# EAGLE schematic COM-TC (EAGLE 8.4.3)
CREVISION: V1; DESIGNER: Henrik K. B. Jensen

## Sheet 1 of 4
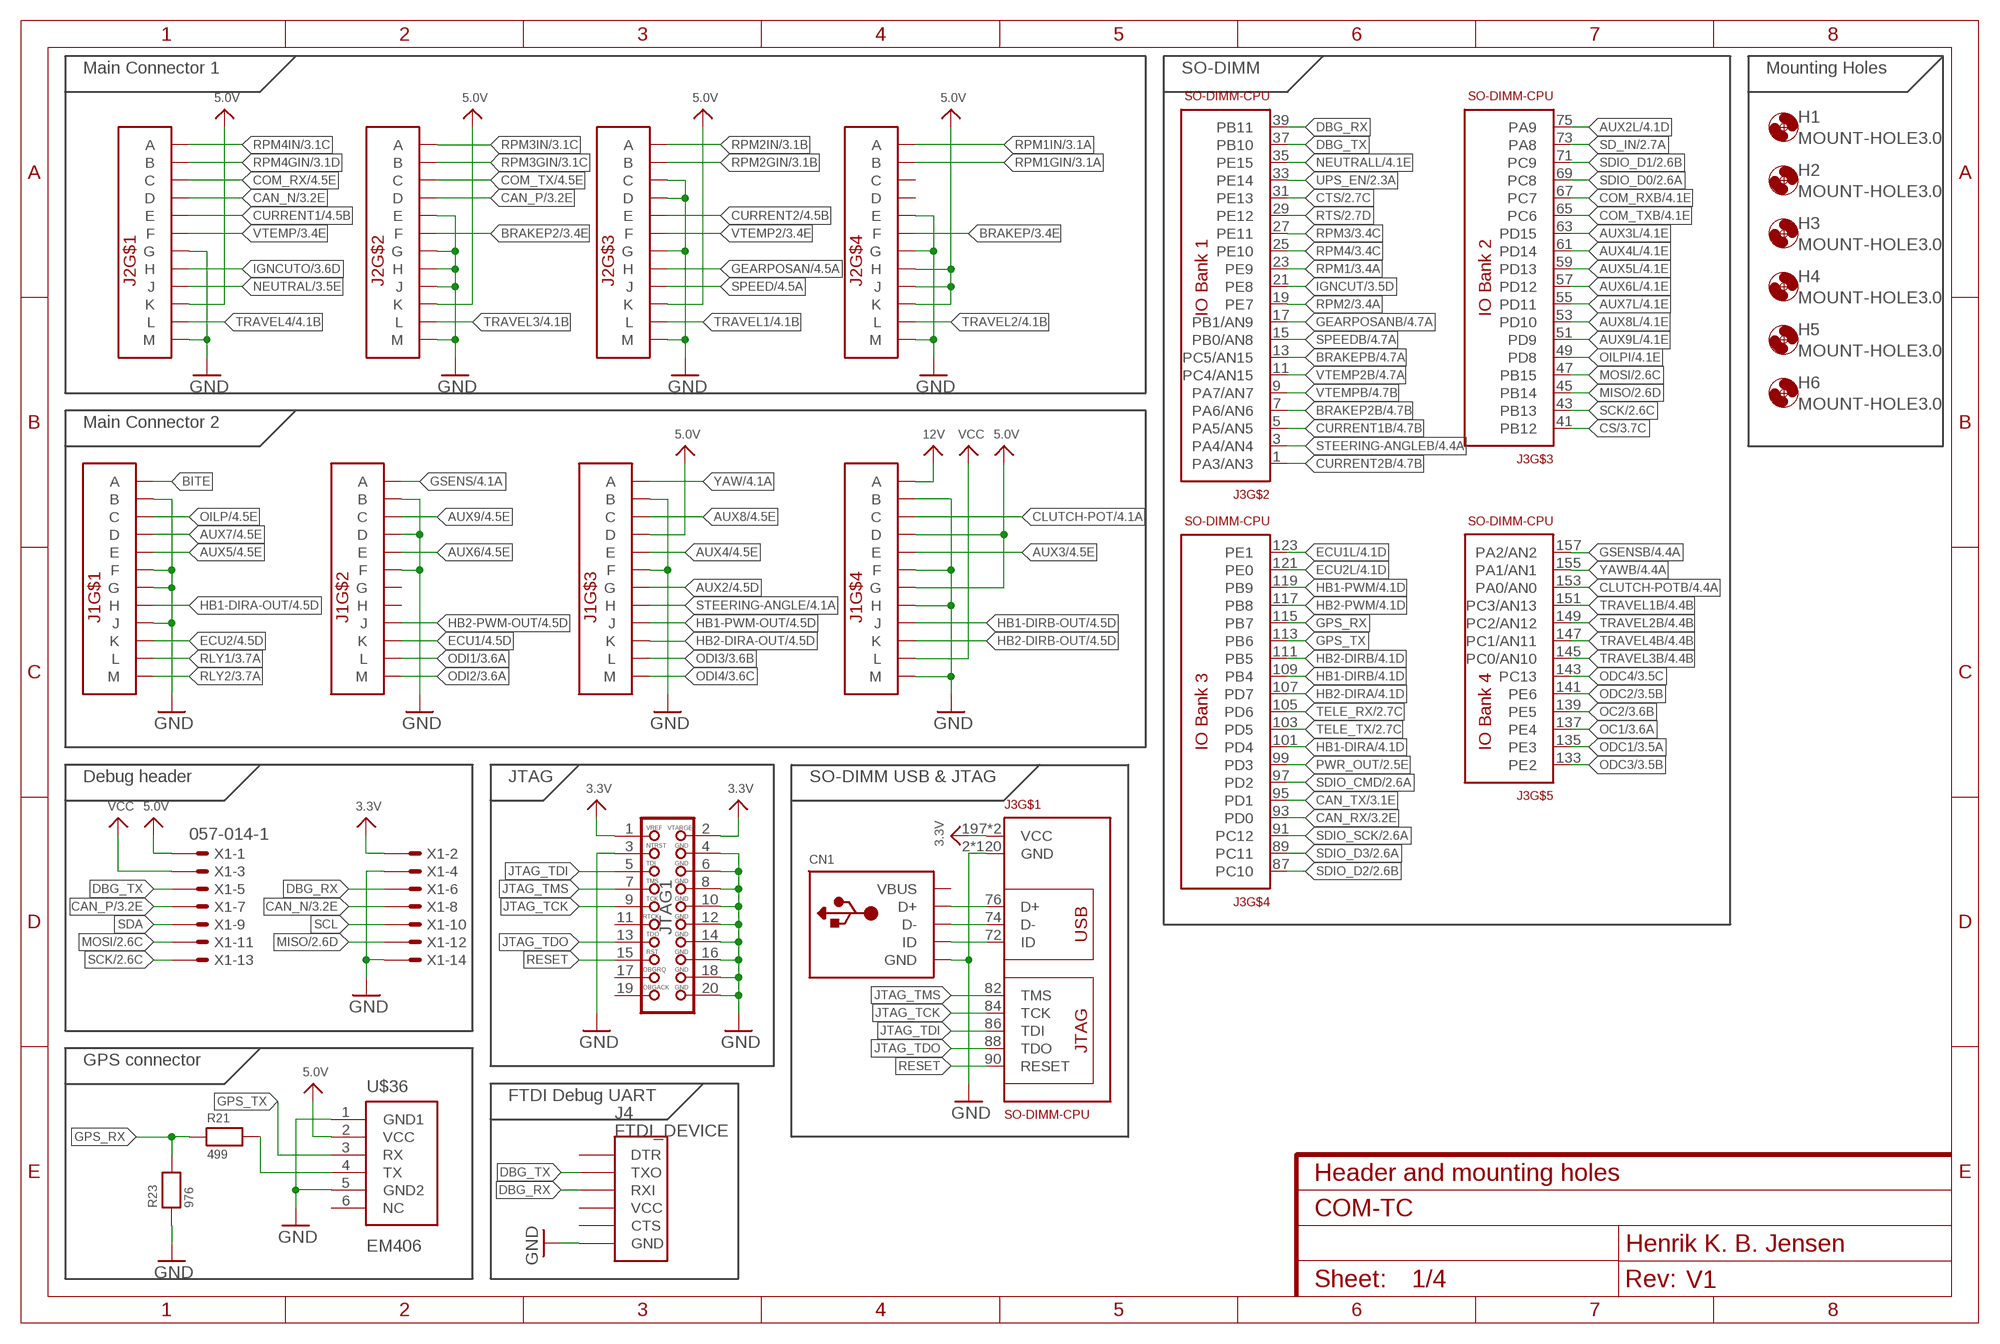
[diagram p0: schematic, sheet 1]

### Parts
CN1  USBMINIBLARGE  [USB-MINIB_LARGER]
H1  MOUNT-HOLE3.0  [3,0]
H2  MOUNT-HOLE3.0  [3,0]
H3  MOUNT-HOLE3.0  [3,0]
H4  MOUNT-HOLE3.0  [3,0]
H5  MOUNT-HOLE3.0  [3,0]
H6  MOUNT-HOLE3.0  [3,0]
J1  CON1  AUTOCONNECTOR  [AUTOCONNECTOR]
J2  CON1  AUTOCONNECTOR  [AUTOCONNECTOR]
J3  SO-DIMM-CPU  [SODIMM-CONNECTOR-2.5V]
J4  FTDI_DEVICE  [FTDI_DEVICE_SIDE]
JTAG1  JTAG-ARM  [JTAG-ARM]
R21  499  RESISTOR_0603  [_0603]
R23  976  RESISTOR_0603  [_0603]
U$36  EM406  [EM406]
X1  057-014-1  [057-014-1]

### Nets
3.3V: J3.197(VCC) J3.199(VCC) JTAG1.1 JTAG1.2 X1.2 ; also sheet 2,3,4
5.0V: J1.D3(D) J1.D4(D) J1.G4(G) J2.H4(H) J2.J4(J) J2.K1(K) J2.K2(K) J2.K3(K) J2.K4(K) U$36.2(VCC) X1.1 ; also sheet 2,3,4
12V: J1.A4(A) ; also sheet 2
_N: CN1.D- J3.74(D-)
_P: CN1.D+ J3.76(D+)
AUX2: J1.G3(G) ; also sheet 4
AUX2L: J3.75(PA9) ; also sheet 4
AUX3: J1.E4(E) ; also sheet 4
AUX3L: J3.63(PD15) ; also sheet 4
AUX4: J1.E3(E) ; also sheet 4
AUX4L: J3.61(PD14) ; also sheet 4
AUX5: J1.E1(E) ; also sheet 4
AUX5L: J3.59(PD13) ; also sheet 4
AUX6: J1.E2(E) ; also sheet 4
AUX6L: J3.57(PD12) ; also sheet 4
AUX7: J1.D1(D) ; also sheet 4
AUX7L: J3.55(PD11) ; also sheet 4
AUX8: J1.C3(C) ; also sheet 4
AUX8L: J3.53(PD10) ; also sheet 4
AUX9: J1.C2(C) ; also sheet 4
AUX9L: J3.51(PD9) ; also sheet 4
BITE: J1.A1(A)
BRAKEP: J2.F4(F) ; also sheet 3,4
BRAKEP2: J2.F2(F) ; also sheet 3,4
BRAKEP2B: J3.7(PA6/AN6) ; also sheet 4
BRAKEPB: J3.13(PC5/AN15) ; also sheet 4
CAN_N: J2.D1(D) X1.8 ; also sheet 3
CAN_P: J2.D2(D) X1.7 ; also sheet 3
CAN_RX: J3.93(PD0) ; also sheet 3
CAN_TX: J3.95(PD1) ; also sheet 3
CLUTCH-POT: J1.C4(C) ; also sheet 4
CLUTCH-POTB: J3.153(PA0/AN0) ; also sheet 4
COM_RX: J2.C1(C) ; also sheet 4
COM_RXB: J3.67(PC7) ; also sheet 4
COM_TX: J2.C2(C) ; also sheet 4
COM_TXB: J3.65(PC6) ; also sheet 4
CS: J3.41(PB12) ; also sheet 3
CTS: J3.31(PE13) ; also sheet 2
CURRENT1: J2.E1(E) ; also sheet 4
CURRENT1B: J3.5(PA5/AN5) ; also sheet 4
CURRENT2: J2.E3(E) ; also sheet 4
CURRENT2B: J3.1(PA3/AN3) ; also sheet 4
DBG_RX: J3.39(PB11) J4.P$3(RXI) X1.6
DBG_TX: J3.37(PB10) J4.P$2(TXO) X1.5
ECU1: J1.K2(K) ; also sheet 4
ECU1L: J3.123(PE1) ; also sheet 4
ECU2: J1.K1(K) ; also sheet 4
ECU2L: J3.121(PE0) ; also sheet 4
GEARPOSAN: J2.H3(H) ; also sheet 4
GEARPOSANB: J3.17(PB1/AN9) ; also sheet 4
GND: CN1.GND J1.B1(B) J1.B2(B) J1.B3(B) J1.B4(B) J1.D2(D) J1.F1(F) J1.F2(F) J1.F3(F) J1.F4(F) J1.G1(G) J1.H4(H) J1.J1(J) J1.M4(M) J2.C3(C) J2.D3(D) J2.E2(E) J2.E4(E) J2.G1(G) J2.G2(G) J2.G3(G) J2.G4(G) J2.H2(H) J2.J2(J) J2.M1(M) J2.M2(M) J2.M3(M) J2.M4(M) J3.2(GND) J3.4(GND) J3.6(GND) J3.8(GND) J3.10(GND) J3.12(GND) J3.14(GND) J3.16(GND) J3.18(GND) J3.20(GND) J3.22(GND) J3.24(GND) J3.26(GND) J3.28(GND) J3.30(GND) J3.32(GND) J3.34(GND) J3.36(GND) J3.38(GND) J3.40(GND) J3.42(GND) J3.44(GND) J3.46(GND) J3.48(GND) J3.50(GND) J3.52(GND) J3.54(GND) J3.56(GND) J3.58(GND) J3.60(GND) J3.62(GND) J3.64(GND) J3.66(GND) J3.68(GND) J3.70(GND) J3.77(GND) J3.78(GND) J3.79(GND) J3.80(GND) J3.81(GND) J3.83(GND) J3.85(GND) J3.92(GND) J3.94(GND) J3.96(GND) J3.98(GND) J3.100(GND) J3.102(GND) J3.104(GND) J3.106(GND) J3.108(GND) J3.110(GND) J3.112(GND) J3.114(GND) J3.116(GND) J3.118(GND) J3.120(GND) J3.122(GND) J3.124(GND) J3.125(GND) J3.126(GND) J3.127(GND) J3.128(GND) J3.129(GND) J3.130(GND) J3.131(GND) J3.132(GND) J3.134(GND) J3.136(GND) J3.138(GND) J3.140(GND) J3.142(GND) J3.144(GND) J3.146(GND) J3.148(GND) J3.150(GND) J3.152(GND) J3.154(GND) J3.156(GND) J3.158(GND) J3.159(GND) J3.160(GND) J3.161(GND) J3.162(GND) J3.163(GND) J3.164(GND) J3.165(GND) J3.166(GND) J3.167(GND) J3.168(GND) J3.169(GND) J3.170(GND) J3.171(GND) J3.172(GND) J3.173(GND) J3.174(GND) J3.175(GND) J3.176(GND) J3.177(GND) J3.178(GND) J3.179(GND) J3.180(GND) J3.181(GND) J3.182(GND) J3.183(GND) J3.184(GND) J3.185(GND) J3.186(GND) J3.187(GND) J3.188(GND) J3.189(GND) J3.190(GND) J3.191(GND) J3.192(GND) J3.193(GND) J3.194(GND) J3.195(GND) J3.196(GND) J3.198(GND) J3.200(GND) J4.P$6(GND) JTAG1.3 JTAG1.4 JTAG1.6 JTAG1.8 JTAG1.10 JTAG1.12 JTAG1.14 JTAG1.16 JTAG1.18 JTAG1.20 R23.1 U$36.1(GND1) U$36.5(GND2) X1.4 X1.14 ; also sheet 2,3,4
GPS_RX: J3.115(PB7) R21.1 R23.2
GPS_TX: J3.113(PB6) U$36.3(RX)
GSENS: J1.A2(A) ; also sheet 4
GSENSB: J3.157(PA2/AN2) ; also sheet 4
HB1-DIRA: J3.101(PD4) ; also sheet 4
HB1-DIRA-OUT: J1.H1(H) ; also sheet 4
HB1-DIRB: J3.109(PB4) ; also sheet 4
HB1-DIRB-OUT: J1.J4(J) ; also sheet 4
HB1-PWM: J3.119(PB9) ; also sheet 4
HB1-PWM-OUT: J1.J3(J) ; also sheet 4
HB2-DIRA: J3.107(PD7) ; also sheet 4
HB2-DIRA-OUT: J1.K3(K) ; also sheet 4
HB2-DIRB: J3.111(PB5) ; also sheet 4
HB2-DIRB-OUT: J1.K4(K) ; also sheet 4
HB2-PWM: J3.117(PB8) ; also sheet 4
HB2-PWM-OUT: J1.J2(J) ; also sheet 4
IGNCUT: J3.21(PE8) ; also sheet 3
IGNCUTO: J2.H1(H) ; also sheet 3
JTAG_TCK: J3.84(TCK) JTAG1.9
JTAG_TDI: J3.86(TDI) JTAG1.5
JTAG_TDO: J3.88(TDO) JTAG1.13
JTAG_TMS: J3.82(TMS) JTAG1.7
MISO: J3.45(PB14) X1.12 ; also sheet 2,3
MOSI: J3.47(PB15) X1.11 ; also sheet 2,3
N$79: CN1.ID J3.72(ID)
NEUTRAL: J2.J1(J) ; also sheet 3,4
NEUTRALL: J3.35(PE15) ; also sheet 4
OC1: J3.137(PE4) ; also sheet 3
OC2: J3.139(PE5) ; also sheet 3
ODC1: J3.135(PE3) ; also sheet 3
ODC2: J3.141(PE6) ; also sheet 3
ODC3: J3.133(PE2) ; also sheet 3
ODC4: J3.143(PC13) ; also sheet 3
ODI1: J1.L2(L) ; also sheet 3
ODI2: J1.M2(M) ; also sheet 3
ODI3: J1.L3(L) ; also sheet 3
ODI4: J1.M3(M) ; also sheet 3
OILP: J1.C1(C) ; also sheet 4
OILPI: J3.49(PD8) ; also sheet 4
PWR_OUT: J3.99(PD3) ; also sheet 2
RESET: J3.90(RESET) JTAG1.15
RLY1: J1.L1(L) ; also sheet 3
RLY2: J1.M1(M) ; also sheet 3
RPM1: J3.23(PE9) ; also sheet 3
RPM1GIN: J2.B4(B) ; also sheet 3
RPM1IN: J2.A4(A) ; also sheet 3
RPM2: J3.19(PE7) ; also sheet 3
RPM2GIN: J2.B3(B) ; also sheet 3
RPM2IN: J2.A3(A) ; also sheet 3
RPM3: J3.27(PE11) ; also sheet 3
RPM3GIN: J2.B2(B) ; also sheet 3
RPM3IN: J2.A2(A) ; also sheet 3
RPM4: J3.25(PE10) ; also sheet 3
RPM4GIN: J2.B1(B) ; also sheet 3
RPM4IN: J2.A1(A) ; also sheet 3
RTS: J3.29(PE12) ; also sheet 2
RXD1: R21.2 U$36.4(TX)
SCK: J3.43(PB13) X1.13 ; also sheet 2,3
SCL: X1.10
SD_IN: J3.73(PA8) ; also sheet 2
SDA: X1.9
SDIO_CMD: J3.97(PD2) ; also sheet 2
SDIO_D0: J3.69(PC8) ; also sheet 2
SDIO_D1: J3.71(PC9) ; also sheet 2
SDIO_D2: J3.87(PC10) ; also sheet 2
SDIO_D3: J3.89(PC11) ; also sheet 2
SDIO_SCK: J3.91(PC12) ; also sheet 2
SPEED: J2.J3(J) ; also sheet 4
SPEEDB: J3.15(PB0/AN8) ; also sheet 4
STEERING-ANGLE: J1.H3(H) ; also sheet 4
STEERING-ANGLEB: J3.3(PA4/AN4) ; also sheet 4
TELE_RX: J3.105(PD6) ; also sheet 2
TELE_TX: J3.103(PD5) ; also sheet 2
TRAVEL1: J2.L3(L) ; also sheet 4
TRAVEL1B: J3.151(PC3/AN13) ; also sheet 4
TRAVEL2: J2.L4(L) ; also sheet 4
TRAVEL2B: J3.149(PC2/AN12) ; also sheet 4
TRAVEL3: J2.L2(L) ; also sheet 4
TRAVEL3B: J3.145(PC0/AN10) ; also sheet 4
TRAVEL4: J2.L1(L) ; also sheet 4
TRAVEL4B: J3.147(PC1/AN11) ; also sheet 4
UPS_EN: J3.33(PE14) ; also sheet 2
VCC: J1.L4(L) X1.3 ; also sheet 2
VTEMP: J2.F1(F) ; also sheet 3,4
VTEMP2: J2.F3(F) ; also sheet 3,4
VTEMP2B: J3.11(PC4/AN15) ; also sheet 4
VTEMPB: J3.9(PA7/AN7) ; also sheet 4
YAW: J1.A3(A) ; also sheet 4
YAWB: J3.155(PA1/AN1) ; also sheet 4
Unconnected: J1.G2(G) J1.H2(H) J2.C4(C) J2.D4(D) J4.P$1(DTR) J4.P$4(VCC) J4.P$5(CTS) JTAG1.11 JTAG1.17 JTAG1.19 U$36.6(NC)

### Notes on the sheet
- Main Connector 1 | SO-DIMM | Mounting Holes
- Main Connector 2
- Debug header | JTAG | SO-DIMM USB & JTAG
- GPS connector
- FTDI Debug UART
- Header and mounting holes

## Sheet 2 of 4
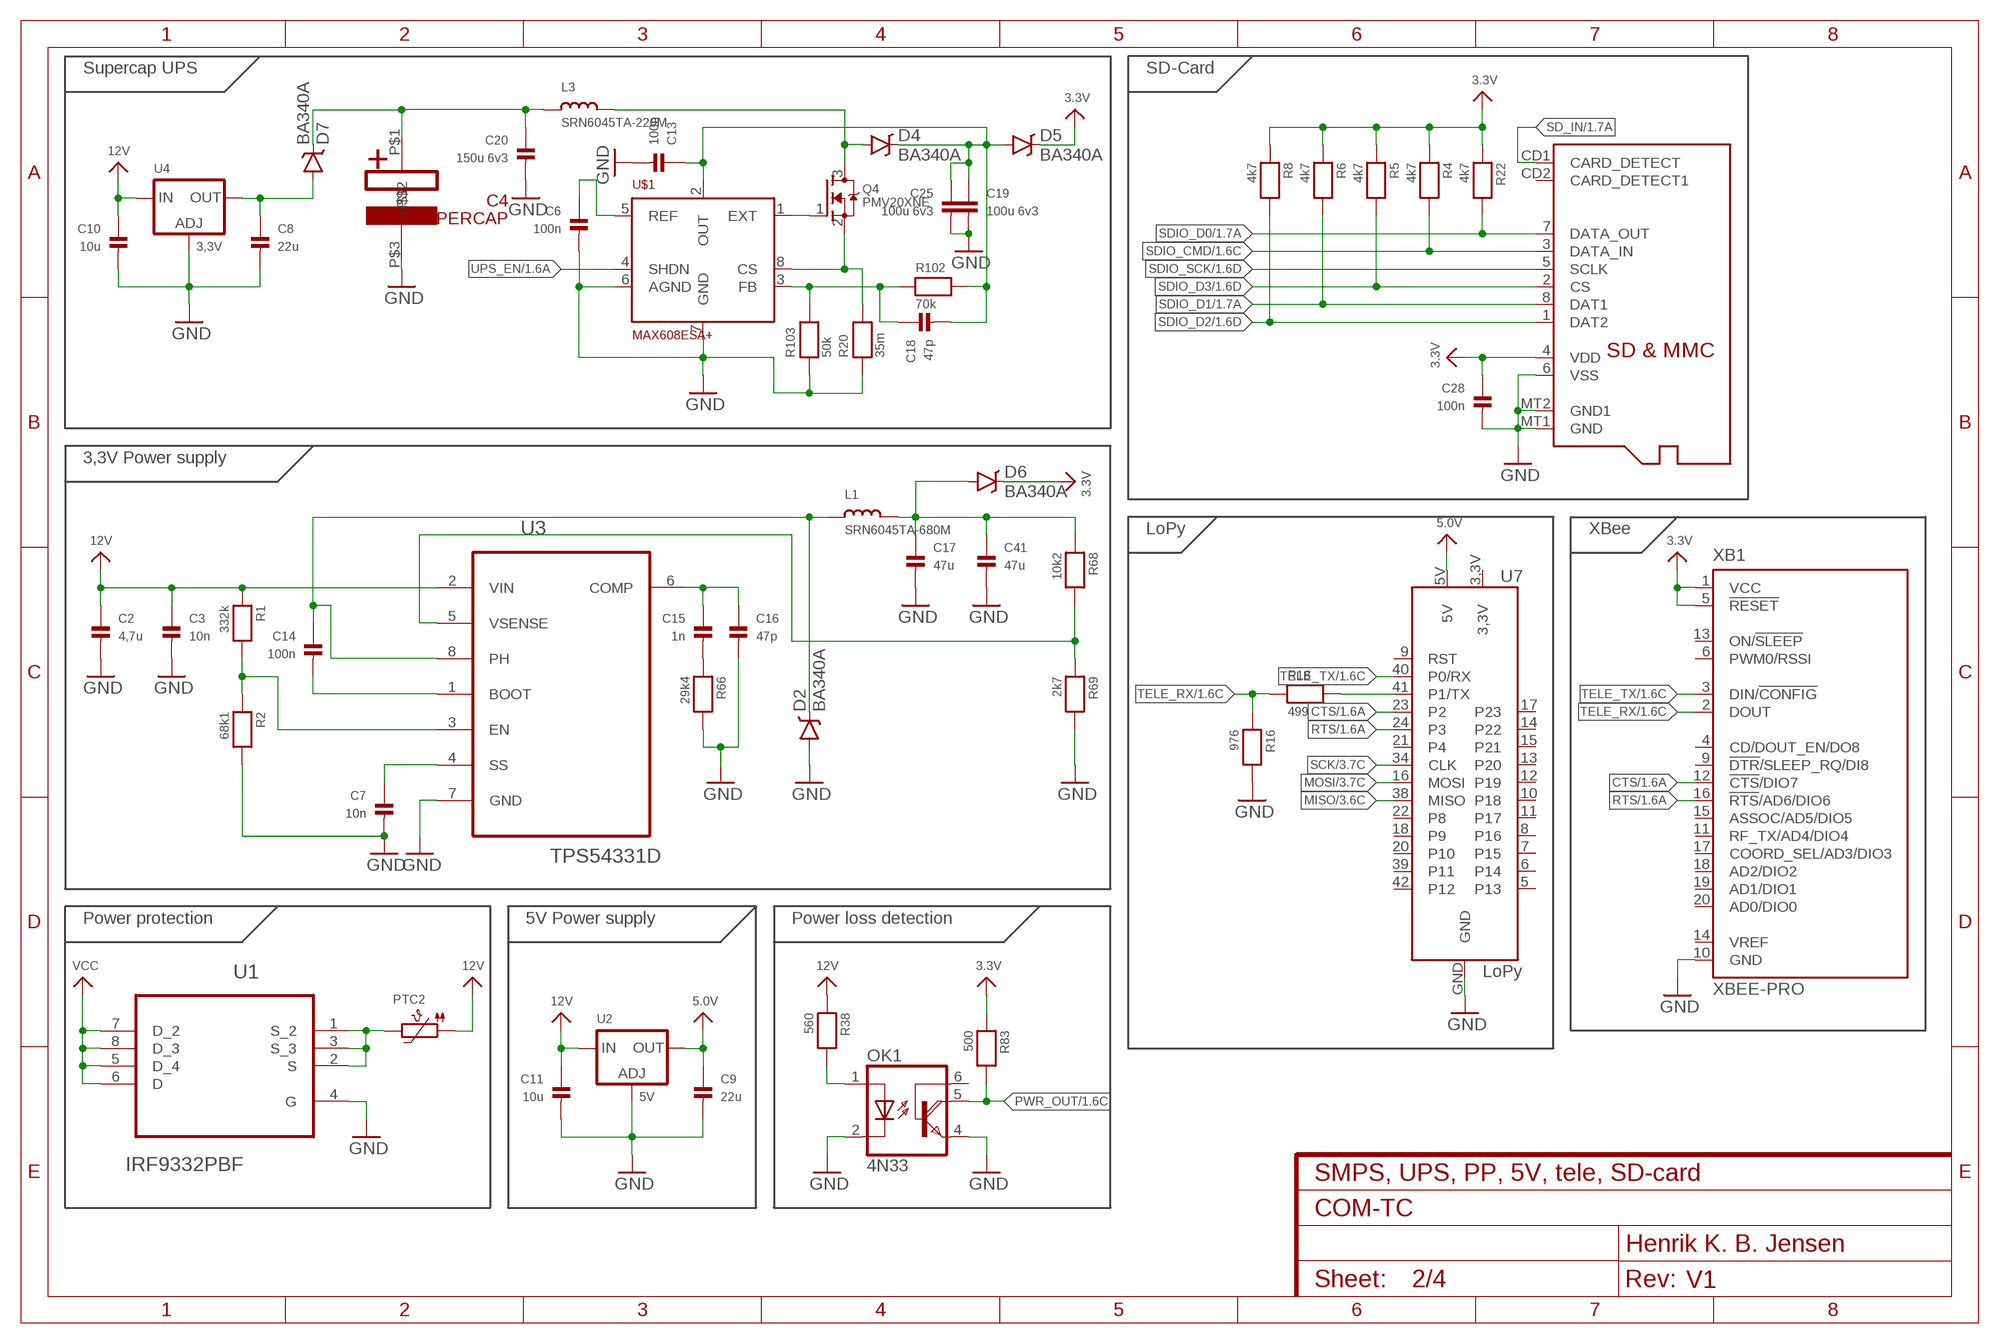
[diagram p1: schematic, sheet 2]

### Parts
C2  4,7u  CAP_CERAMIC_0805  [_0805]
C3  10n  CAP_CERAMIC_0603  [_0603]
C4  SUPERCAP  [SUPERCAP]
C6  100n  CAP_CERAMIC_0603  [_0603]
C7  10n  CAP_CERAMIC_0603  [_0603]
C8  22u  CAP_CERAMIC_0805  [_0805]
C9  22u  CAP_CERAMIC_0805  [_0805]
C10  10u  CAP_CERAMIC_0805  [_0805]
C11  10u  CAP_CERAMIC_0805  [_0805]
C13  100n  CAP_CERAMIC_0603  [_0603]
C14  100n  CAP_CERAMIC_0603  [_0603]
C15  1n  CAP_CERAMIC_0603  [_0603]
C16  47p  CAP_CERAMIC_0603  [_0603]
C17  47u  CAP_CERAMIC_0805  [_0805]
C18  47p  CAP_CERAMIC_0603  [_0603]
C19  100u 6v3  CAP_CERAMIC1206  [1206]
C20  150u 6v3  CAP_CERAMIC1206  [1206]
C25  100u 6v3  CAP_CERAMIC1206  [1206]
C28  100n  CAP_CERAMIC_0603  [_0603]
C41  47u  CAP_CERAMIC_0805  [_0805]
D2  BA340A  B340A  [SMA-DIODE]
D4  BA340A  B340A  [SMA-DIODE]
D5  BA340A  B340A  [SMA-DIODE]
D6  BA340A  B340A  [SMA-DIODE]
D7  BA340A  B340A  [SMA-DIODE]
L1  SRN6045TA-680M  INDUCTORTDK_VLC6045  [INDUCTOR_6X6MM_TDK_VLC6045]
L3  SRN6045TA-220M  INDUCTORTDK_VLC6045  [INDUCTOR_6X6MM_TDK_VLC6045]
OK1  4N33  [DIL06]
PTC2  PTC1812  [PTC1812]
Q4  PMV20XNE  MOSFET-NREFLOW  [SOT23]
R1  332k  RESISTOR_0603  [_0603]
R2  68k1  RESISTOR_0603  [_0603]
R4  4k7  RESISTOR_0603  [_0603]
R5  4k7  RESISTOR_0603  [_0603]
R6  4k7  RESISTOR_0603  [_0603]
R8  4k7  RESISTOR_0603  [_0603]
R16  976  RESISTOR_0603  [_0603]
R18  499  RESISTOR_0603  [_0603]
R20  35m  RESISTOR1206  [1206]
R22  4k7  RESISTOR_0603  [_0603]
R38  560  RESISTOR_0603  [_0603]
R66  29k4  RESISTOR_0603  [_0603]
R68  10k2  RESISTOR_0603  [_0603]
R69  2k7  RESISTOR_0603  [_0603]
R83  500  RESISTOR_0603  [_0603]
R102  70k  RESISTOR_0603  [_0603]
R103  50k  RESISTOR_0603  [_0603]
U1  IRF9332PBF  [SOIC127P600X175-8N]
U2  5V  LM1117SOT223-REFLOW  [SOT223-R]
U3  TPS54331D  [SOIC127P600X175-8N]
U4  3,3V  LM1117SOT223-REFLOW  [SOT223-R]
U7  LoPy  LOPY  [LOPY]
U$1  MAX608ESA+  [SO08]
U$2  MICROSD  [MICROSD]
XB1  XBEE-PRO  [XBEE-PRO]

### Nets
3.3V: C28.1 D5.C D6.C R4.1 R5.1 R6.1 R8.1 R22.1 R83.1 U$2.4(VDD) XB1.1(VCC) XB1.5(!RESET) ; also sheet 1,3,4
5.0V: C9.1 U2.2(OUT) U7.5V ; also sheet 1,3,4
12V: C2.1 C3.1 C10.1 C11.1 PTC2.P$1 R1.1 R38.1 U2.3(IN) U3.2(VIN) U4.3(IN) ; also sheet 1
CTS: U7.23(P2) XB1.12(!CTS!/DIO7) ; also sheet 1
GND: C2.2 C3.2 C4.P$3 C6.2 C7.2 C8.2 C9.2 C10.2 C11.2 C13.2 C16.2 C17.2 C19.2 C20.2 C25.2 C28.2 C41.2 D2.A OK1.2(C) OK1.4(E) R2.2 R16.2 R20.1 R66.2 R69.2 R103.1 U1.4(G) U2.1(ADJ) U3.7(GND) U4.1(ADJ) U7.GND U$1.6(AGND) U$1.7(GND) U$2.6(VSS) U$2.MT1(GND) U$2.MT2(GND1) XB1.10(GND) ; also sheet 1,3,4
MISO: U7.38(MISO) ; also sheet 1,3
MOSI: U7.16(MOSI) ; also sheet 1,3
N$1: C7.1 U3.4(SS)
N$2: R1.2 R2.1 U3.3(EN)
N$3: C17.1 C41.1 D6.A L1.P$2 R68.1
N$4: C8.1 D7.A U4.2(OUT)
N$7: Q4.1(G) U$1.1(EXT)
N$12: PTC2.P$2 U1.1(S_2) U1.2(S) U1.3(S_3)
N$22: OK1.1(A) R38.2
N$27: Q4.2(S) R20.2 U$1.8(CS)
N$28: C13.1 C18.2 C19.1 C25.1 D4.C D5.A R102.2 U$1.2(OUT)
N$29: C6.1 U$1.5(REF)
N$30: C18.1 R102.1 R103.2 U$1.3(FB)
N$35: R18.2 U7.41(P1/TX)
N$36: D4.A L3.P$2 Q4.3(D)
N$37: C14.2 U3.1(BOOT)
N$45: C14.1 D2.C L1.P$1 U3.8(PH)
N$50: C15.2 R66.1
N$66: C15.1 C16.1 U3.6(COMP)
N$72: R68.2 R69.1 U3.5(VSENSE)
PWR_OUT: OK1.5(COL) R83.2 ; also sheet 1
RTS: U7.24(P3) XB1.16(!RTS!/AD6/DIO6) ; also sheet 1
SCK: U7.34(CLK) ; also sheet 1,3
SD_IN: U$2.CD1(CARD_DETECT) ; also sheet 1
SDIO_CMD: R4.2 U$2.3(DATA_IN) ; also sheet 1
SDIO_D0: R22.2 U$2.7(DATA_OUT) ; also sheet 1
SDIO_D1: R6.2 U$2.8(DAT1) ; also sheet 1
SDIO_D2: R8.2 U$2.1(DAT2) ; also sheet 1
SDIO_D3: R5.2 U$2.2(CS) ; also sheet 1
SDIO_SCK: U$2.5(SCLK) ; also sheet 1
SUPERCAP: C4.P$1 C20.1 D7.C L3.P$1
TELE_RX: R16.1 R18.1 XB1.2(DOUT) ; also sheet 1
TELE_TX: U7.40(P0/RX) XB1.3(DIN/!CONFIG) ; also sheet 1
UPS_EN: U$1.4(SHDN) ; also sheet 1
VCC: U1.5(D_4) U1.6(D) U1.7(D_2) U1.8(D_3) ; also sheet 1
Unconnected: OK1.6(B) U7.3,3V U7.5(P13) U7.6(P14) U7.7(P15) U7.8(P16) U7.9(RST) U7.10(P18) U7.11(P17) U7.12(P19) U7.13(P20) U7.14(P22) U7.15(P21) U7.17(P23) U7.18(P9) U7.20(P10) U7.21(P4) U7.22(P8) U7.39(P11) U7.42(P12) U$2.CD2(CARD_DETECT1) XB1.4(CD/DOUT_EN/DO8) XB1.6(PWM0/RSSI) XB1.9(!DTR!/SLEEP_RQ/DI8) XB1.11(RF_TX/AD4/DIO4) XB1.13(ON/!SLEEP) XB1.14(VREF) XB1.15(ASSOC/AD5/DIO5) XB1.17(COORD_SEL/AD3/DIO3) XB1.18(AD2/DIO2) XB1.19(AD1/DIO1) XB1.20(AD0/DIO0)

### Notes on the sheet
- Supercap UPS | SD-Card
- 3,3V Power supply
- LoPy | XBee
- Power protection | 5V Power supply | Power loss detection
- SMPS, UPS, PP, 5V, tele, SD-card

## Sheet 3 of 4
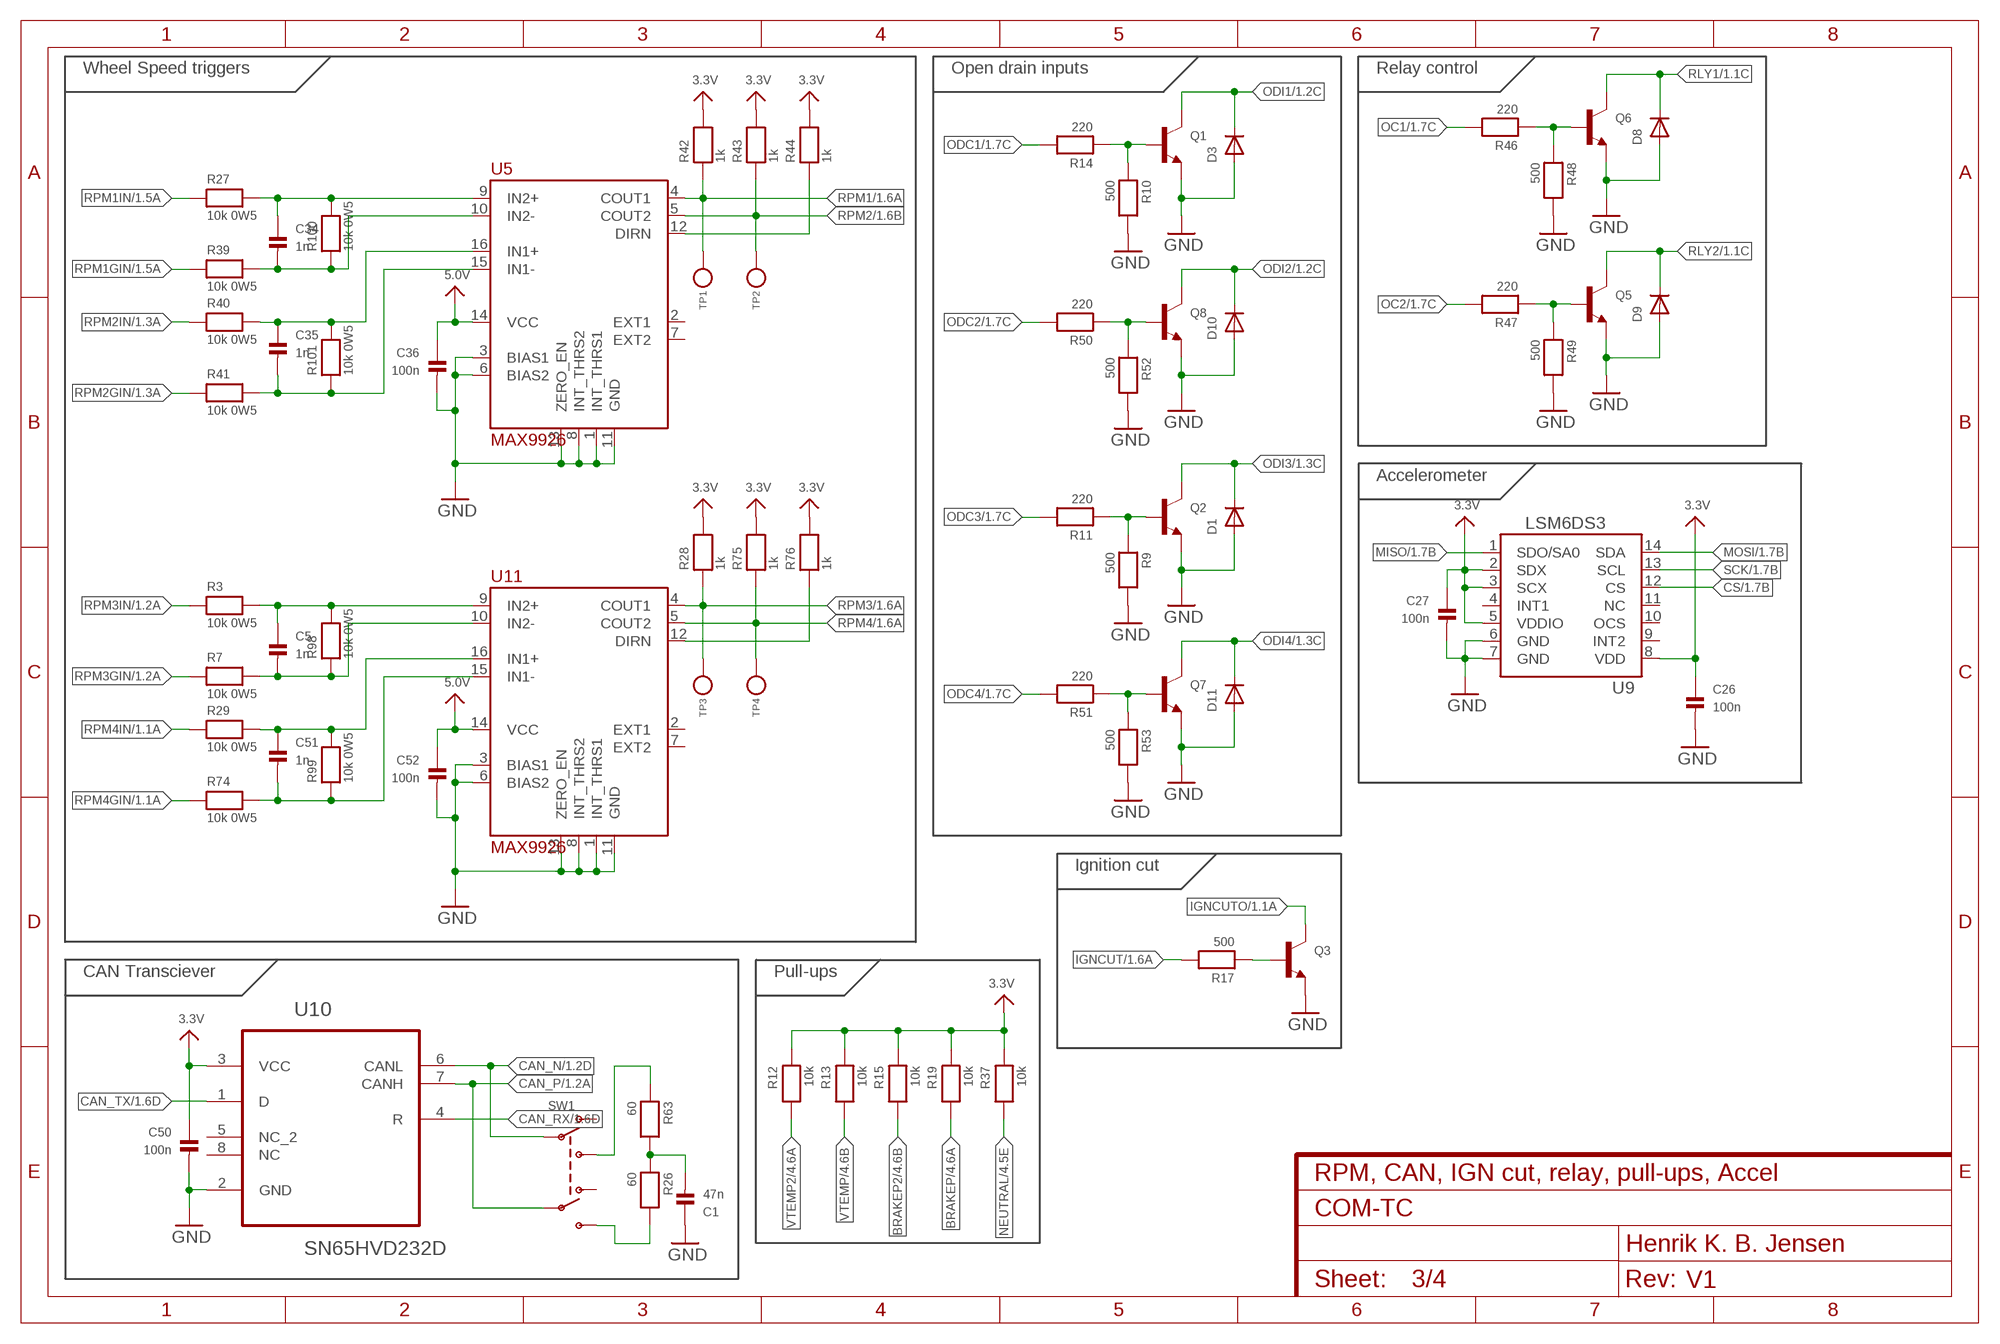
[diagram p2: schematic, sheet 3]

### Parts
C1  47n  CAP_CERAMIC_0603  [_0603]
C5  1n  CAP_CERAMIC_0603  [_0603]
C26  100n  CAP_CERAMIC_0603  [_0603]
C27  100n  CAP_CERAMIC_0603  [_0603]
C34  1n  CAP_CERAMIC_0603  [_0603]
C35  1n  CAP_CERAMIC_0603  [_0603]
C36  100n  CAP_CERAMIC_0603  [_0603]
C50  100n  CAP_CERAMIC_0603  [_0603]
C51  1n  CAP_CERAMIC_0603  [_0603]
C52  100n  CAP_CERAMIC_0603  [_0603]
D1  DIODESOD-323F  [SOD-323F]
D3  DIODESOD-323F  [SOD-323F]
D8  DIODESOD-323F  [SOD-323F]
D9  DIODESOD-323F  [SOD-323F]
D10  DIODESOD-323F  [SOD-323F]
D11  DIODESOD-323F  [SOD-323F]
Q1  TRANSISTOR_NPNWIDE  [SOT23-WIDE]
Q2  TRANSISTOR_NPNWIDE  [SOT23-WIDE]
Q3  TRANSISTOR_NPNWIDE  [SOT23-WIDE]
Q5  TRANSISTOR_NPNWIDE  [SOT23-WIDE]
Q6  TRANSISTOR_NPNWIDE  [SOT23-WIDE]
Q7  TRANSISTOR_NPNWIDE  [SOT23-WIDE]
Q8  TRANSISTOR_NPNWIDE  [SOT23-WIDE]
R3  10k 0W5  RESISTOR_0805  [_0805]
R7  10k 0W5  RESISTOR_0805  [_0805]
R9  500  RESISTOR_0603  [_0603]
R10  500  RESISTOR_0603  [_0603]
R11  220  RESISTOR_0603  [_0603]
R12  10k  RESISTOR_0603  [_0603]
R13  10k  RESISTOR_0603  [_0603]
R14  220  RESISTOR_0603  [_0603]
R15  10k  RESISTOR_0603  [_0603]
R17  500  RESISTOR_0603  [_0603]
R19  10k  RESISTOR_0603  [_0603]
R26  60  RESISTOR_0603  [_0603]
R27  10k 0W5  RESISTOR_0805  [_0805]
R28  1k  RESISTOR_0603  [_0603]
R29  10k 0W5  RESISTOR_0805  [_0805]
R37  10k  RESISTOR_0603  [_0603]
R39  10k 0W5  RESISTOR_0805  [_0805]
R40  10k 0W5  RESISTOR_0805  [_0805]
R41  10k 0W5  RESISTOR_0805  [_0805]
R42  1k  RESISTOR_0603  [_0603]
R43  1k  RESISTOR_0603  [_0603]
R44  1k  RESISTOR_0603  [_0603]
R46  220  RESISTOR_0603  [_0603]
R47  220  RESISTOR_0603  [_0603]
R48  500  RESISTOR_0603  [_0603]
R49  500  RESISTOR_0603  [_0603]
R50  220  RESISTOR_0603  [_0603]
R51  220  RESISTOR_0603  [_0603]
R52  500  RESISTOR_0603  [_0603]
R53  500  RESISTOR_0603  [_0603]
R63  60  RESISTOR_0603  [_0603]
R74  10k 0W5  RESISTOR_0805  [_0805]
R75  1k  RESISTOR_0603  [_0603]
R76  1k  RESISTOR_0603  [_0603]
R98  10k 0W5  RESISTOR_0805  [_0805]
R99  10k 0W5  RESISTOR_0805  [_0805]
R100  10k 0W5  RESISTOR_0805  [_0805]
R101  10k 0W5  RESISTOR_0805  [_0805]
SW1  SWITCH_DPDT  [DPDT_SMT_JS202011SCQN]
TP1  TEST_POINT_0.040IN  [TESTPOINT_0.040IN]
TP2  TEST_POINT_0.040IN  [TESTPOINT_0.040IN]
TP3  TEST_POINT_0.040IN  [TESTPOINT_0.040IN]
TP4  TEST_POINT_0.040IN  [TESTPOINT_0.040IN]
U5  MAX9926  [SOP63P600X175-16N]
U9  LSM6DS3  LSM6DS3DOT_INDICATION  [LGA14L_DOT_INDICATOR]
U10  SN65HVD232D  [SOIC127P600X175-8N]
U11  MAX9926  [SOP63P600X175-16N]

### Nets
3.3V: C26.1 C27.1 C50.1 R12.1 R13.1 R15.1 R19.1 R28.2 R37.1 R42.2 R43.2 R44.2 R75.2 R76.2 U9.2(SDX) U9.3(SCX) U9.5(VDDIO) U9.8(VDD) U10.3(VCC) ; also sheet 1,2,4
5.0V: C36.1 C52.1 U5.14(VCC) U11.14(VCC) ; also sheet 1,2,4
BRAKEP: R19.2 ; also sheet 1,4
BRAKEP2: R15.2 ; also sheet 1,4
CAN_N: SW1.P$2(P1) U10.6(CANL) ; also sheet 1
CAN_P: SW1.P$5(P2) U10.7(CANH) ; also sheet 1
CAN_RX: U10.4(R) ; also sheet 1
CAN_TX: U10.1(D) ; also sheet 1
CS: U9.12(CS) ; also sheet 1
GND: C1.1 C26.2 C27.2 C36.2 C50.2 C52.2 D1.A D3.A D8.A D9.A D10.A D11.A Q1.2(E) Q2.2(E) Q3.2(E) Q5.2(E) Q6.2(E) Q7.2(E) Q8.2(E) R9.2 R10.2 R48.2 R49.2 R52.2 R53.2 U5.1(INT_THRS1) U5.3(BIAS1) U5.6(BIAS2) U5.8(INT_THRS2) U5.11(GND) U5.13(ZERO_EN) U9.6(GND) U9.7(GND) U10.2(GND) U11.1(INT_THRS1) U11.3(BIAS1) U11.6(BIAS2) U11.8(INT_THRS2) U11.11(GND) U11.13(ZERO_EN) ; also sheet 1,2,4
IGNCUT: R17.2 ; also sheet 1
IGNCUTO: Q3.3(C) ; also sheet 1
MISO: U9.1(SDO/SA0) ; also sheet 1,2
MOSI: U9.14(SDA) ; also sheet 1,2
N$5: R63.1 SW1.P$3(S1)
N$6: Q2.1(B) R9.1 R11.1
N$8: C1.2 R26.1 R63.2
N$9: Q6.1(B) R46.1 R48.1
N$10: Q1.1(B) R10.1 R14.1
N$11: C34.1 R27.2 R100.2 U5.9(IN2+)
N$14: Q5.1(B) R47.1 R49.1
N$15: C35.2 R41.2 R101.1 U5.15(IN1-)
N$16: C5.1 R3.2 R98.2 U11.9(IN2+)
N$17: C35.1 R40.2 R101.2 U5.16(IN1+)
N$18: C34.2 R39.2 R100.1 U5.10(IN2-)
N$19: C51.2 R74.2 R99.1 U11.15(IN1-)
N$20: Q8.1(B) R50.1 R52.1
N$21: Q7.1(B) R51.1 R53.1
N$24: Q3.1(B) R17.1
N$25: C51.1 R29.2 R99.2 U11.16(IN1+)
N$26: C5.2 R7.2 R98.1 U11.10(IN2-)
N$31: R44.1 U5.12(DIRN)
N$32: R26.2 SW1.P$4(S2)
N$67: R76.1 U11.12(DIRN)
NEUTRAL: R37.2 ; also sheet 1,4
OC1: R46.2 ; also sheet 1
OC2: R47.2 ; also sheet 1
ODC1: R14.2 ; also sheet 1
ODC2: R50.2 ; also sheet 1
ODC3: R11.2 ; also sheet 1
ODC4: R51.2 ; also sheet 1
ODI1: D3.C Q1.3(C) ; also sheet 1
ODI2: D10.C Q8.3(C) ; also sheet 1
ODI3: D1.C Q2.3(C) ; also sheet 1
ODI4: D11.C Q7.3(C) ; also sheet 1
RLY1: D8.C Q6.3(C) ; also sheet 1
RLY2: D9.C Q5.3(C) ; also sheet 1
RPM1: R42.1 TP1.TESTPOINT U5.4(COUT1) ; also sheet 1
RPM1GIN: R39.1 ; also sheet 1
RPM1IN: R27.1 ; also sheet 1
RPM2: R43.1 TP2.TESTPOINT U5.5(COUT2) ; also sheet 1
RPM2GIN: R41.1 ; also sheet 1
RPM2IN: R40.1 ; also sheet 1
RPM3: R28.1 TP3.TESTPOINT U11.4(COUT1) ; also sheet 1
RPM3GIN: R7.1 ; also sheet 1
RPM3IN: R3.1 ; also sheet 1
RPM4: R75.1 TP4.TESTPOINT U11.5(COUT2) ; also sheet 1
RPM4GIN: R74.1 ; also sheet 1
RPM4IN: R29.1 ; also sheet 1
SCK: U9.13(SCL) ; also sheet 1,2
VTEMP: R13.2 ; also sheet 1,4
VTEMP2: R12.2 ; also sheet 1,4
Unconnected: SW1.P$1(O1) SW1.P$6(O2) U5.2(EXT1) U5.7(EXT2) U9.4(INT1) U9.9(INT2) U9.10(OCS) U9.11(NC) U10.5(NC_2) U10.8(NC) U11.2(EXT1) U11.7(EXT2)

### Notes on the sheet
- Wheel Speed triggers | Open drain inputs | Relay control
- Accelerometer
- Ignition cut
- CAN Transciever | Pull-ups
- RPM, CAN, IGN cut, relay, pull-ups, Accel

## Sheet 4 of 4
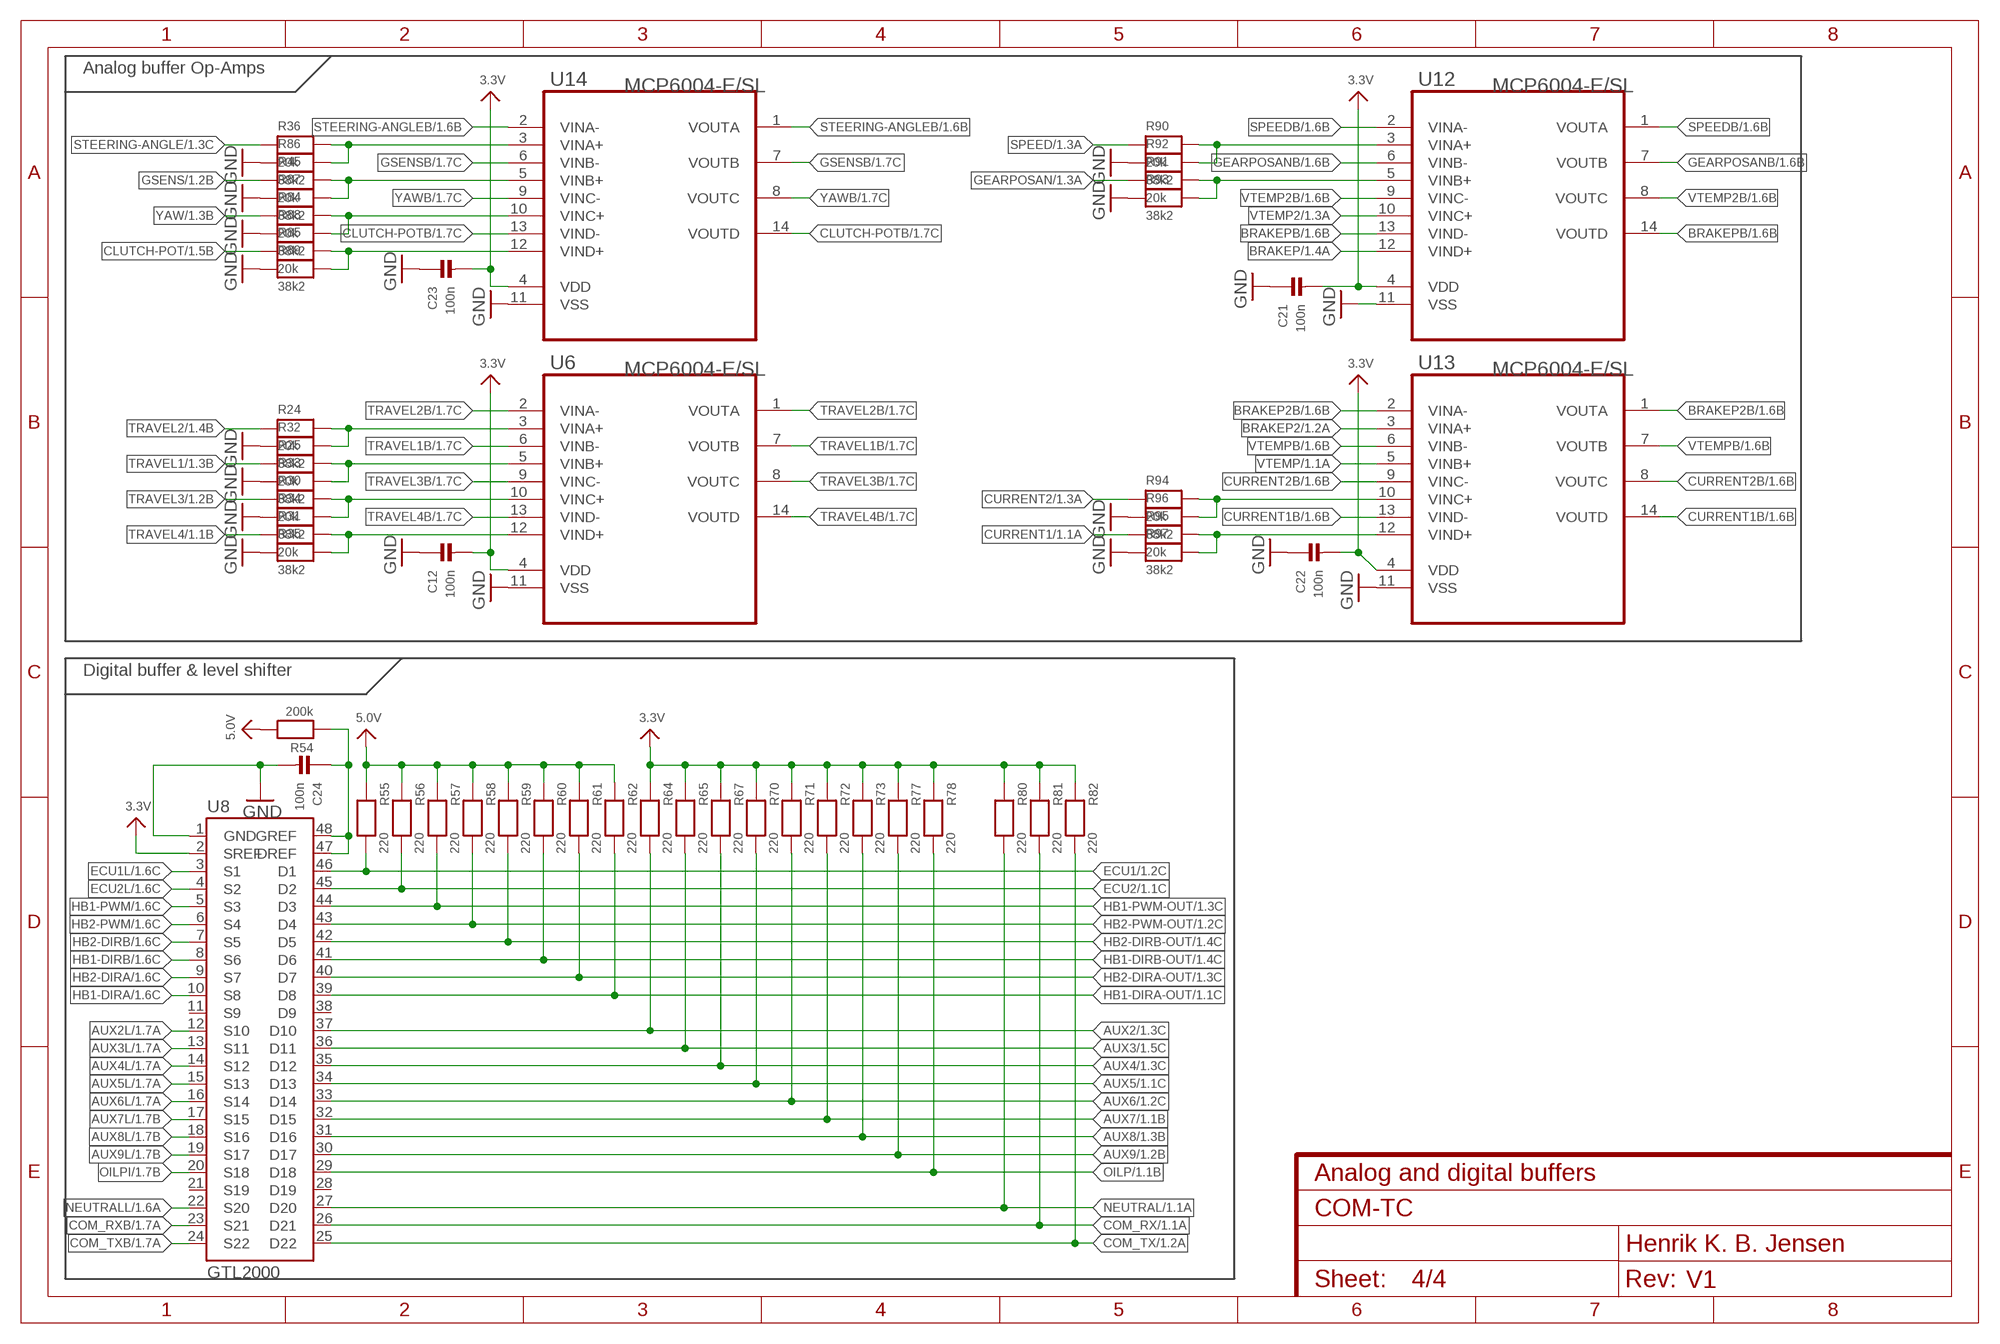
[diagram p3: schematic, sheet 4]

### Parts
C12  100n  CAP_CERAMIC_0603  [_0603]
C21  100n  CAP_CERAMIC_0603  [_0603]
C22  100n  CAP_CERAMIC_0603  [_0603]
C23  100n  CAP_CERAMIC_0603  [_0603]
C24  100n  CAP_CERAMIC_0603  [_0603]
R24  20k  RESISTOR_0603  [_0603]
R25  20k  RESISTOR_0603  [_0603]
R30  20k  RESISTOR_0603  [_0603]
R31  20k  RESISTOR_0603  [_0603]
R32  38k2  RESISTOR_0603  [_0603]
R33  38k2  RESISTOR_0603  [_0603]
R34  38k2  RESISTOR_0603  [_0603]
R35  38k2  RESISTOR_0603  [_0603]
R36  20k  RESISTOR_0603  [_0603]
R45  20k  RESISTOR_0603  [_0603]
R54  200k  RESISTOR_0603  [_0603]
R55  220  RESISTOR_0603  [_0603]
R56  220  RESISTOR_0603  [_0603]
R57  220  RESISTOR_0603  [_0603]
R58  220  RESISTOR_0603  [_0603]
R59  220  RESISTOR_0603  [_0603]
R60  220  RESISTOR_0603  [_0603]
R61  220  RESISTOR_0603  [_0603]
R62  220  RESISTOR_0603  [_0603]
R64  220  RESISTOR_0603  [_0603]
R65  220  RESISTOR_0603  [_0603]
R67  220  RESISTOR_0603  [_0603]
R70  220  RESISTOR_0603  [_0603]
R71  220  RESISTOR_0603  [_0603]
R72  220  RESISTOR_0603  [_0603]
R73  220  RESISTOR_0603  [_0603]
R77  220  RESISTOR_0603  [_0603]
R78  220  RESISTOR_0603  [_0603]
R80  220  RESISTOR_0603  [_0603]
R81  220  RESISTOR_0603  [_0603]
R82  220  RESISTOR_0603  [_0603]
R84  20k  RESISTOR_0603  [_0603]
R85  20k  RESISTOR_0603  [_0603]
R86  38k2  RESISTOR_0603  [_0603]
R87  38k2  RESISTOR_0603  [_0603]
R88  38k2  RESISTOR_0603  [_0603]
R89  38k2  RESISTOR_0603  [_0603]
R90  20k  RESISTOR_0603  [_0603]
R91  20k  RESISTOR_0603  [_0603]
R92  38k2  RESISTOR_0603  [_0603]
R93  38k2  RESISTOR_0603  [_0603]
R94  20k  RESISTOR_0603  [_0603]
R95  20k  RESISTOR_0603  [_0603]
R96  38k2  RESISTOR_0603  [_0603]
R97  38k2  RESISTOR_0603  [_0603]
U6  MCP6004-E/SL  [SOIC127P600X175-14N]
U8  GTL2000  [TSSOP48]
U12  MCP6004-E/SL  [SOIC127P600X175-14N]
U13  MCP6004-E/SL  [SOIC127P600X175-14N]
U14  MCP6004-E/SL  [SOIC127P600X175-14N]

### Nets
3.3V: C12.2 C21.2 C22.2 C23.2 R64.1 R65.1 R67.1 R70.1 R71.1 R72.1 R73.1 R77.1 R78.1 R80.1 R81.1 R82.1 U6.4(VDD) U8.2(SREF) U12.4(VDD) U13.4(VDD) U14.4(VDD) ; also sheet 1,2,3
5.0V: R54.2 R55.1 R56.1 R57.1 R58.1 R59.1 R60.1 R61.1 R62.1 ; also sheet 1,2,3
AUX2: R64.2 U8.37(D10) ; also sheet 1
AUX2L: U8.12(S10) ; also sheet 1
AUX3: R65.2 U8.36(D11) ; also sheet 1
AUX3L: U8.13(S11) ; also sheet 1
AUX4: R67.2 U8.35(D12) ; also sheet 1
AUX4L: U8.14(S12) ; also sheet 1
AUX5: R70.2 U8.34(D13) ; also sheet 1
AUX5L: U8.15(S13) ; also sheet 1
AUX6: R71.2 U8.33(D14) ; also sheet 1
AUX6L: U8.16(S14) ; also sheet 1
AUX7: R72.2 U8.32(D15) ; also sheet 1
AUX7L: U8.17(S15) ; also sheet 1
AUX8: R73.2 U8.31(D16) ; also sheet 1
AUX8L: U8.18(S16) ; also sheet 1
AUX9: R77.2 U8.30(D17) ; also sheet 1
AUX9L: U8.19(S17) ; also sheet 1
BRAKEP: U12.12(VIND+) ; also sheet 1,3
BRAKEP2: U13.3(VINA+) ; also sheet 1,3
BRAKEP2B: U13.1(VOUTA) U13.2(VINA-) ; also sheet 1
BRAKEPB: U12.13(VIND-) U12.14(VOUTD) ; also sheet 1
CLUTCH-POT: R85.1 ; also sheet 1
CLUTCH-POT1: R31.2 R35.2 U6.12(VIND+)
CLUTCH-POTB: U14.13(VIND-) U14.14(VOUTD) ; also sheet 1
COM_RX: R81.2 U8.26(D21) ; also sheet 1
COM_RXB: U8.23(S21) ; also sheet 1
COM_TX: R82.2 U8.25(D22) ; also sheet 1
COM_TXB: U8.24(S22) ; also sheet 1
CURRENT1: R95.1 ; also sheet 1
CURRENT1B: U13.13(VIND-) U13.14(VOUTD) ; also sheet 1
CURRENT2: R94.1 ; also sheet 1
CURRENT2B: U13.8(VOUTC) U13.9(VINC-) ; also sheet 1
ECU1: R55.2 U8.46(D1) ; also sheet 1
ECU1L: U8.3(S1) ; also sheet 1
ECU2: R56.2 U8.45(D2) ; also sheet 1
ECU2L: U8.4(S2) ; also sheet 1
GEARPOSAN: R91.1 ; also sheet 1
GEARPOSANB: U12.6(VINB-) U12.7(VOUTB) ; also sheet 1
GND: C12.1 C21.1 C22.1 C23.1 C24.2 R32.1 R33.1 R34.1 R35.1 R86.1 R87.1 R88.1 R89.1 R92.1 R93.1 R96.1 R97.1 U6.11(VSS) U8.1(GND) U12.11(VSS) U13.11(VSS) U14.11(VSS) ; also sheet 1,2,3
GSENS: R45.1 ; also sheet 1
GSENSB: U14.6(VINB-) U14.7(VOUTB) ; also sheet 1
GSENSL1: R25.2 R33.2 U6.5(VINB+)
GSENSL2: R91.2 R93.2 U12.5(VINB+)
GSENSL3: R95.2 R97.2 U13.12(VIND+)
HB1-DIRA: U8.10(S8) ; also sheet 1
HB1-DIRA-OUT: R62.2 U8.39(D8) ; also sheet 1
HB1-DIRB: U8.8(S6) ; also sheet 1
HB1-DIRB-OUT: R60.2 U8.41(D6) ; also sheet 1
HB1-PWM: U8.5(S3) ; also sheet 1
HB1-PWM-OUT: R57.2 U8.44(D3) ; also sheet 1
HB2-DIRA: U8.9(S7) ; also sheet 1
HB2-DIRA-OUT: R61.2 U8.40(D7) ; also sheet 1
HB2-DIRB: U8.7(S5) ; also sheet 1
HB2-DIRB-OUT: R59.2 U8.42(D5) ; also sheet 1
HB2-PWM: U8.6(S4) ; also sheet 1
HB2-PWM-OUT: R58.2 U8.43(D4) ; also sheet 1
N$13: R85.2 R89.2 U14.12(VIND+)
N$23: C24.1 R54.1 U8.47(DREF) U8.48(GREF)
N$34: R84.2 R88.2 U14.10(VINC+)
N$38: R45.2 R87.2 U14.5(VINB+)
N$39: R36.2 R86.2 U14.3(VINA+)
NEUTRAL: R80.2 U8.27(D20) ; also sheet 1,3
NEUTRALL: U8.22(S20) ; also sheet 1
OILP: R78.2 U8.29(D18) ; also sheet 1
OILPI: U8.20(S18) ; also sheet 1
SPEED: R90.1 ; also sheet 1
SPEEDB: U12.1(VOUTA) U12.2(VINA-) ; also sheet 1
STEERING-ANGLE: R36.1 ; also sheet 1
STEERING-ANGLE1: R24.2 R32.2 U6.3(VINA+)
STEERING-ANGLE2: R90.2 R92.2 U12.3(VINA+)
STEERING-ANGLE3: R94.2 R96.2 U13.10(VINC+)
STEERING-ANGLEB: U14.1(VOUTA) U14.2(VINA-) ; also sheet 1
TRAVEL1: R25.1 ; also sheet 1
TRAVEL1B: U6.6(VINB-) U6.7(VOUTB) ; also sheet 1
TRAVEL2: R24.1 ; also sheet 1
TRAVEL2B: U6.1(VOUTA) U6.2(VINA-) ; also sheet 1
TRAVEL3: R30.1 ; also sheet 1
TRAVEL3B: U6.8(VOUTC) U6.9(VINC-) ; also sheet 1
TRAVEL4: R31.1 ; also sheet 1
TRAVEL4B: U6.13(VIND-) U6.14(VOUTD) ; also sheet 1
VTEMP: U13.5(VINB+) ; also sheet 1,3
VTEMP2: U12.10(VINC+) ; also sheet 1,3
VTEMP2B: U12.8(VOUTC) U12.9(VINC-) ; also sheet 1
VTEMPB: U13.6(VINB-) U13.7(VOUTB) ; also sheet 1
YAW: R84.1 ; also sheet 1
YAWB: U14.8(VOUTC) U14.9(VINC-) ; also sheet 1
YAWL1: R30.2 R34.2 U6.10(VINC+)
Unconnected: U8.11(S9) U8.21(S19) U8.28(D19) U8.38(D9)

### Notes on the sheet
- Analog buffer Op-Amps
- Digital buffer & level shifter
- Analog and digital buffers

## Power pins joined to a net without a drawn wire
VBUS: CN1.VBUS

## Library data of the parts
C1-C3 C5-C28 C34-C36 C41 C50-C52 = microbuilder:CAP_CERAMIC: Ceramic Capacitors 0402 - 0402 Surface Mount Capacitors 16pF 50V 5% [Digikey: 445-4899-2-ND] 18pF 50V 5% [Digikey: 490-1281-2-ND] 22pF 50V 5% [Digikey: 490-1283-2-ND] 68pF 50V 5% [Digikey: 490-1289-2-ND] 0.1uF 10V 10% [Digikey: 490-1318-2-ND] 1.0uF 6.3V 10% [Digikey: 490-1320-2-ND] 0603 - 0603 Surface Mount Capacitors 16 pF 50V 5% [Digikey: 445-5051-2-ND] 22 pF 50V [Digikey: PCC220ACVTR-ND] 33 pF 50V 5% [Digikey: 490-1415-1-ND] 56pF 50V 5% [Digikey: 490-1421-1-ND] 220pF 50V 5% [Digikey: 445-1285-1-ND] 680 pF 50V 2200 pF 50V 5% C0G [Digikey: 445-1297-1-ND] 5600 pF 100V 5% X7R [Digikey: 478-3711-1-ND] 0.1 µF 25V 10% [Digikey: PCC2277TR-ND] 0.22 µF 16V 10% X7R [Digikey: 445-1318-1-ND] 1.0 µF 25V 10% [Digikey: 445-5146-2-ND] 0603 - RF Specific 3pF 250V +/-0.1pF RF [Digikey: 712-1347-1-ND] 18 pF 250V 5% [Digikey: 478-3505-1-ND or 712-1322-1-ND] 56 pF 250V 5% C0G RF [Digikey: 490-4867-1-ND] 68 pF 250V RF [Digikey: 490-4868-1-ND] 0805 - 0805 Surface Mount Capacitors 220 pF 250V 2% RF Ceramic Capacitor [Digikey: 712-1398-1-ND] 1000 pF 50V 2% NP0 Ceramic Capacitor [Digikey: 478-3760-1-ND] 0.1 µF 25V 10% Ceramic Capacitor [Digikey: PCC1828TR-ND] 1.0 µF 16V 10% Ceramic Capacitor[Digikey: 490-1691-2-ND] 10.0 µF 10V 10% Ceramic Capacitor[Digikey: 709-1228-1-ND] 10.0 uF 16V 10% Ceramic Capacitor [Digikey: 478-5165-2-ND] 47 uF 6.3V 20% Ceramic Capacitor [Digikey: 587-1779-1-ND or 399-5506-1-ND] 1206 - 1206 Surface Mount Capacitors 47uF 10V 20% Ceramic Capacitor [Digikey: 490-5528-1-ND or 399-5508-1-ND or 445-6010-1-ND] 100uF 6.3V -20%, +80% Y5V Ceramic Capacitor (Digikey: 490-4512-1-ND, Mouser: 81-GRM31CF50J107ZE1L)
C4 = unicorn_v2:SUPERCAP
CN1 = microbuilder:USB: USB Connectors USBMINIB - Surface Mount Female Mini-B USB Connector 4UConnector: 06564
D1 D3 D8-D11 = adafruit:DIODE: Diode SMADIODE - SMA Surface Mount Package 20V 1A Schottky Diode Digikey: 641-1014-6-ND DO-1N4148 - Through Hole Small Current Diode SOD-123 20V 1 A (.5mV Vf) Schottky Diode - Digikey: MBRX120TPMSCT-ND SOD-323 10V 570mA (.38mV Vf, 3ns) Schottky Diode - Digikey: ZLLS410CT-ND SOD-523 30V 30mA Schottky Diode (RB751S-40TE61) - Digikey: RB751S-40TE61CT-ND SOT23-R/W - SOT23 Package (R = Solder Paste/Reflow Ovens, W = Hand-Soldering) BAT54Film 40V 300mA - Digikey: 497-7162-1-ND
D2 D4-D7 = SparkFun-DiscreteSemi:B340A: Schottky Diode 3A-40V; PROD_ID: DIO-09886
H1-H6 = holes:MOUNT-HOLE: MOUNTING HOLE with drill center marker
J1 J2 = unicorn_v2:AUTOCONNECTOR
J3 = AAU-Racing:SO-DIMM-CPU
J4 = SparkFun-Connectors:FTDI_DEVICE: Connector which mates to FTDI basic or FTDI cable.
JTAG1 = microbuilder:JTAG-ARM: 20 Pin JTAG Connector For use with ARM7, and ARM9. Supported by some Cortex M3 boards with SWJ-DP interfaces (dual SWP/JTAG support). 4UConnector: 03556
L1 L3 = microbuilder:INDUCTOR: Inductors 0603: 10nH Ceramic Inductor - microwire antenna/RF (Digikey: 712-1434-2-ND) 0805: 560nH Ceramic Inductor - RF (Digikey: 553-1047-1-ND) 270nH Ceramic Inductor - Q = 40@250MHz, +-5%, 1 Ohm DC Resistance (Digikey: 535-10506-2-ND) 1007 (2518 Metric) SMT: 10µH 10% 250mOhm 820mA 1007 Inductor (Digikey: 587-2189-1-ND) 22µH 10% 500mOhm 580mA 1007 Inductor (Digikey: 587-2190-1-ND) 47µH 10% 950mOhm 420mA 1007 Inductor (Digikey: 587-2191-1-ND) 47µH 5% 100mOhm 1A 1008 Inductor (Digikey: 732-1816-1-ND) 5.0x5.0mm (Taiyo Yuden NR5040 Series) 6.8µH 20% 2.3A 64mOhm Inductor (Digikey: 587-2374-2-ND) 5.0x5.0mm (TDK VLC5045 Series) 4.7µH 20% 3.3A 34mOhm Inductor (Digikey: 445-6526-1-ND) 6.8µH 20% 2.7A 46mOhm Inductor (Digikey: 445-6527-1-ND) 6.0x6.0mm (TDK VLC6045 Series) 4.7µH 20% 3.8A 27mOhm Inductor (Digikey: 445-6538-2-ND) 6.8µH 20% 3A 41mOhm Inductor (Digikey: 445-6540-1-ND) 6.2µH 30% 2.2A 45mOhm Inductor (Digikey: SRR5028-6R2YCT-ND) - Not TDK VLC6045 but footprint should match 6.0x6.0mm (TDK SLF6045 Series) 6.8uH 30% 2A 33mOhm Inductor (Digikey: 445-4572-1-ND, Mouser: 810-SLF645T6R8N2R0PF)
OK1 = optocoupler:4N33: MOTOROLA OPTO COUPLER; MF: VISHAY/TELEFUNKEN; MPN: 4N33; OC_FARNELL: 1469601; OC_NEWARK: 88K1390
PTC2 = microbuilder:PTC: PTC (Resettable Fuse) 1206 Package 250mA PTC (16V Max, Time-to-Trip: 0.08s) - Digikey: F2110CT-ND 1210 Package 100mA PTC (30V Max, Time-to-Trip: 0.6s) - Digikey: MF-USMF010-2CT-ND 1812 Package 750mA PTC (24V Max, Time-to-Trip: 0.2s) - Digikey: MF-MSMF075/24-2CT-ND
Q1-Q3 Q5-Q8 = microbuilder:TRANSISTOR_NPN: NPN Transistor Transistor (NPN) 500mA 45V - BC817 [Digikey: 568-1631-1-ND] Transistor (NPN) 500mA 45V - BC817,215 [Mouser: 771-BC817-T/R] SOT23-R - SOT23 footprint optimised for use with solder paste and reflow ovens. SOT23-W - SOT23 footprint optimised for hand-soldering (larger pads).
Q4 = adafruit:MOSFET-N: N-Channel Mosfet 2N7002E - 60V 260mA SOT23 [Digikey: 2N7002ET1GOSTR-ND] - REEL BSH103 - 30V 850mA SOT23 [Digikey: 568-5013-1-ND]
R1-R78 R80-R103 = microbuilder:RESISTOR: Resistors 0402 - 0402 Surface Mount Package 22 Ohm 1% 1/16W [Digikey: 311-22.0LRTR-ND] 33 Ohm 5% 1/16W 1.0K 5% 1/16W 1.5K 5% 1/16W 2.0K 1% 1/16W 10.0K 1% 1/16W [Digikey: 311-10.0KLRTR-ND] 10.0K 5% 1/16W [Digikey: RMCF0402JT10K0TR-ND] 12.1K 1% 1/16W [Digikey: 311-22.0LRTR-ND] 100.0K 5% 1/16W 0603 - 0603 Surface Mount Package 0 Ohm 1/10 Watt 1% Resistor 15 Ohm 1/10 Watt 1% Resistor 33 Ohm 1/10 Watt 1% Resistor 49.9 Ohm 1/10 Watt 1% Resistor 100 Ohm 1/10 Watt 1% Resistor 150 Ohm 1/10 Watt 1% Resistor 240 Ohm 1/10 Watt 1% Resistor 390 Ohm 1/10 Watt 1% Resistor 560 Ohm 1/10 Watt 1% Resistor 680 Ohm 1/10 Watt 1% Resistor 750 Ohm 1/10 Watt 1% Resistor 1.0K Ohm 1/10 Watt 1% Resistor 1.5K Ohm 1/10 Watt 1% Resistor 2.0K Ohm 1/10 Watt 1% Resistor 2.2K Ohm 1/10 Watt 1% Resistor 3.3K Ohm 1/10 Watt 1% Resistor 4.7K Ohm 1/10 Watt 1% Resistor 10.0K Ohm 1/10 Watt 1% Resistor 12.0K Ohm 1/10 Watt 1% Resistor 12.1K Ohm 1/10 Watt 1% Resistor 20.0K Ohm 1/10 Watt 1% Resistor 33.0K Ohm 1/10 Watt 1% Resistor 100.0K Ohm 1/10 Watt 1% Resistor 0805 - 0805 Surface Mount Package 0 Ohm 1/8 Watt 1% Resistor 33 Ohm 1/8 Watt 1% Resistor 100 Ohm 1/8 Watt 1% Resistor 150 Ohm 1/8 Watt 1% Resistor 200 Ohm 1/8 Watt 1% Resistor 240 Ohm 1/8 Watt 1% Resistor 330 Ohm 1/8 Watt 1% Resistor 390 Ohm 1/8 Watt 1% Resistor 470 Ohm 1/8 Watt 1% Resistor 1.0K Ohm 1/8 Watt 1% Resistor 1.5K Ohm 1/8 Watt 1% Resistor 2.0K Ohm 1/8 Watt 1% Resistor 4.7K Ohm 1/8 Watt 1% Resistor 5.1K Ohm 1/8 Watt 1% Resistor 5.6K Ohm 1/8 Watt 1% Resistor 10.0K Ohm 1/8 Watt 1% Resistor 22.0K Ohm 1/8 Watt 1% Resistor 33.0K Ohm 1/8 Watt 1% Resistor 100K Ohm 1/8 Watt 1% Resistor 1206 - 1206 Surface Mount Package 2012 - 2010 Surface Mount Package 0.11 Ohm 1/2 Watt 1% Resistor - Digikey: RHM.11UCT-ND
SW1 = microbuilder:SWITCH_DPDT: Switch - DPDT A DPDT Switch acts like an SPDT switch, but has a pair of switches instead of just one. Vertical - 0.3A @ 6V SMT - Digikey: JS202011SCQN
TP1-TP4 = headers:TEST_POINT_0.040IN: 0.040in Test Point; DIGIKEY: 5001K-ND
U1 = International_Rectifier_By_element14_Batch_1:IRF9332PBF: HEXFET Power MOSFET; MPN: IRF9332PBF; OC_FARNELL: 1857354; OC_NEWARK: 12T9892; PACKAGE: SOIC-8; SUPPLIER: INTERNATIONAL RECTIFIER
U2 U4 = microbuilder:LM1117: LM1117 Voltage Regulator LM1117 Adjustable Voltage regulator [Digikey: LM1117IMP-ADJDKR-ND] LM1117 3.3V Voltage regulator [AP1117E33GDIDKR-ND] LM1117 5.0V Voltage regulator [AP1117E50GDIDKR-ND] SOT223-REFLOW - SOT223 package for solder paste/reflow ovens SOT223-WAVE - SOT223 package for hand-soldering (larger pads) Note: For the fixed-voltage regulators, simply set the ADJ pin to GND.
U3 = Texas Instruments_By_element14_Batch_1:TPS54331D: 3A, 28V INPUT, STEP DOWN SWIFT? DC/DC CONVERTER WITH ECO-MODE?; MPN: TPS54331D; OC_FARNELL: 1645383; OC_NEWARK: 03P1641; PACKAGE: SOIC-8; SUPPLIER: TI
U5 U11 = AAU-Racing:MAX9926
U6 U12-U14 = Microchip_By_element14_Batch_1:MCP6004-E/SL: IC, OP AMP, QUAD 1MHZ, SMD,; MPN: MCP6004-E/SL; OC_FARNELL: 1332122; OC_NEWARK: 34M7475; PACKAGE: SOIC14; SUPPLIER: Microchip
U7 = AAU-Racing:LOPY
U8 = AAU-Racing:GTL2000
U9 = LSM6DS3:LSM6DS3; PROD_ID: IC-12969
U10 = Texas Instruments_By_element14_Batch_1:SN65HVD232D: 3.3-V CAN TRANSCEIVERS; MPN: SN65HVD232D; OC_FARNELL: 1103107; OC_NEWARK: 35K4890; PACKAGE: SOIC-8; SUPPLIER: Texas Instruments
U$1 = AAU-Racing:MAX608ESA+
U$2 = adafruit:MICROSD: Micro-SD / Transflash card holder with SPI pinout For the 3M # 2908-05WB-MG and/or 4UCON #19656 push-push type
U$36 = SparkFun:EM406: EM406 Connector Proven layout and schematic for EM406 connector. Spark Fun Electronics SKU : GPS-00579
X1 = con-panduit:057-014-: CONNECTOR 10-pin series 057 contact pc board low profile headers
XB1 = maxstream:XBEE: XBee (TM) /XBee-PRO(TM) OEM RF Modules Source: MaxStream, Inc. xbee_productmanual.pdf; MPN: XBP24-AWI-001; OC_FARNELL: 1337916; OC_NEWARK: 42M2667